# Altium schematic sheet AnalogConnectors.SchDoc: Analog RJ45 Connectors
size Letter; Engineer: Nathan Petersen; DocumentNumber: 15; Revision: v1.2; SheetNumber: 15; SheetTotal: 26
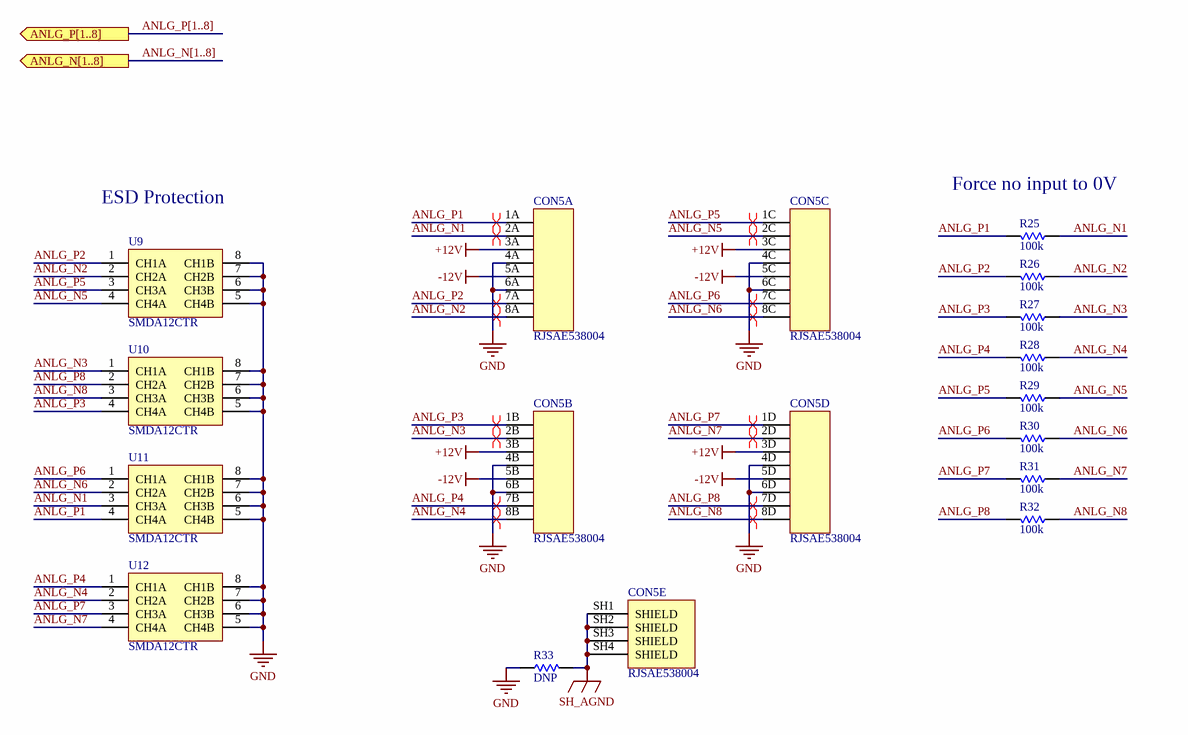
[diagram p0: AnalogConnectors.SchDoc]

## Parts
CON5  RJSAE538004  [RJSAE538004]  (parts A,B,C,D,E of 5)
R25  value 100k  [0603-RES]  (hidden comment: Resistor)
R26  value 100k  [0603-RES]  (hidden comment: Resistor)
R27  value 100k  [0603-RES]  (hidden comment: Resistor)
R28  value 100k  [0603-RES]  (hidden comment: Resistor)
R29  value 100k  [0603-RES]  (hidden comment: Resistor)
R30  value 100k  [0603-RES]  (hidden comment: Resistor)
R31  value 100k  [0603-RES]  (hidden comment: Resistor)
R32  value 100k  [0603-RES]  (hidden comment: Resistor)
R33  value DNP  [0603-RES]  (hidden comment: Resistor)
U9  SMDA12CTR  [SOIC127P600X175-8N]
U10  SMDA12CTR  [SOIC127P600X175-8N]
U11  SMDA12CTR  [SOIC127P600X175-8N]
U12  SMDA12CTR  [SOIC127P600X175-8N]

## Ports
ANLG_N[1..8] (out), ANLG_P[1..8] (out)

## Nets
+12V: CON5.3A CON5.3B CON5.3C CON5.3D
-12V: CON5.5A CON5.5B CON5.5C CON5.5D
GND: CON5.4A CON5.4B CON5.4C CON5.4D CON5.6A CON5.6B CON5.6C CON5.6D R33.1 U9.5(CH4B) U9.6(CH3B) U9.7(CH2B) U9.8(CH1B) U10.5(CH4B) U10.6(CH3B) U10.7(CH2B) U10.8(CH1B) U11.5(CH4B) U11.6(CH3B) U11.7(CH2B) U11.8(CH1B) U12.5(CH4B) U12.6(CH3B) U12.7(CH2B) U12.8(CH1B)
SH_AGND: CON5.SH1(SHIELD) CON5.SH2(SHIELD) CON5.SH3(SHIELD) CON5.SH4(SHIELD) R33.2
ANLG_N1: CON5.2A R25.1 U11.3(CH3A)
ANLG_N2: CON5.8A R26.1 U9.2(CH2A)
ANLG_N3: CON5.2B R27.1 U10.1(CH1A)
ANLG_N4: CON5.8B R28.1 U12.2(CH2A)
ANLG_N5: CON5.2C R29.1 U9.4(CH4A)
ANLG_N6: CON5.8C R30.1 U11.2(CH2A)
ANLG_N7: CON5.2D R31.1 U12.4(CH4A)
ANLG_N8: CON5.8D R32.1 U10.3(CH3A)
ANLG_P1: CON5.1A R25.2 U11.4(CH4A)
ANLG_P2: CON5.7A R26.2 U9.1(CH1A)
ANLG_P3: CON5.1B R27.2 U10.4(CH4A)
ANLG_P4: CON5.7B R28.2 U12.1(CH1A)
ANLG_P5: CON5.1C R29.2 U9.3(CH3A)
ANLG_P6: CON5.7C R30.2 U11.1(CH1A)
ANLG_P7: CON5.1D R31.2 U12.3(CH3A)
ANLG_P8: CON5.7D R32.2 U10.2(CH2A)

## Buses and harness runs
bus ANLG_N[1..8] = port ANLG_N[1..8]
bus ANLG_P[1..8] = port ANLG_P[1..8]

## Layout directives
differential pair: ANLG_N1, ANLG_N2, ANLG_N3, ANLG_N4, ANLG_N5, ANLG_N6, ANLG_N7, ANLG_N8, ANLG_P1, ANLG_P2, ANLG_P3, ANLG_P4, ANLG_P5, ANLG_P6, ANLG_P7, ANLG_P8

## Notes on the sheet
- ESD Protection
- (near R25) Force no input to 0V
- Title:
- File:
- Sheet:
- of
- Revision:
- Time:
- Date:
- Engineer:

## Library data of the parts
CON5 = RJSAE538004: CONN MOD JACK 8P8C R/A SHIELDED; Supplier 1: Digi-Key; Supplier Part Number 1: RJSAE538004-ND
U9-U12 = SMDA12CTR: TVS DIODE 12V 19V 8SO; Supplier 1: Digi-Key; Supplier Part Number 1: 1655-1701-1-ND
R25-R33 = Resistor: Supplier 1: Digi-Key
  R25-R32: Supplier Part Number 1: 311-100KLDCT-ND
  R33: Supplier Part Number 1: P0.0GCT-ND